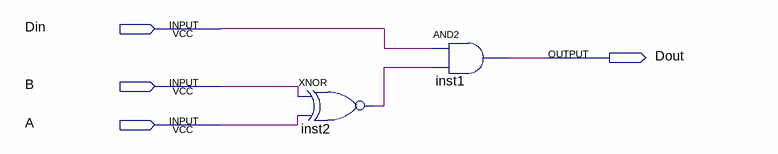
[diagram p0: schematic sheet]
// Quartus schematic igualdade_de1bits.bdf as structural Verilog: 2 symbols, 4 pins
module igualdade_de1bits (
  input  Din,
  input  B,
  input  A,
  output Dout
);

  wire inst2_out;

  xnor inst2 (inst2_out, B, A);
  and inst1 (Dout, Din, inst2_out);
endmodule
